# Altium schematic sheet Power Sources and Supply.SchDoc
size Tabloid; DrawnBy: Krutav Shah; SheetNumber: 4; SheetTotal: 6
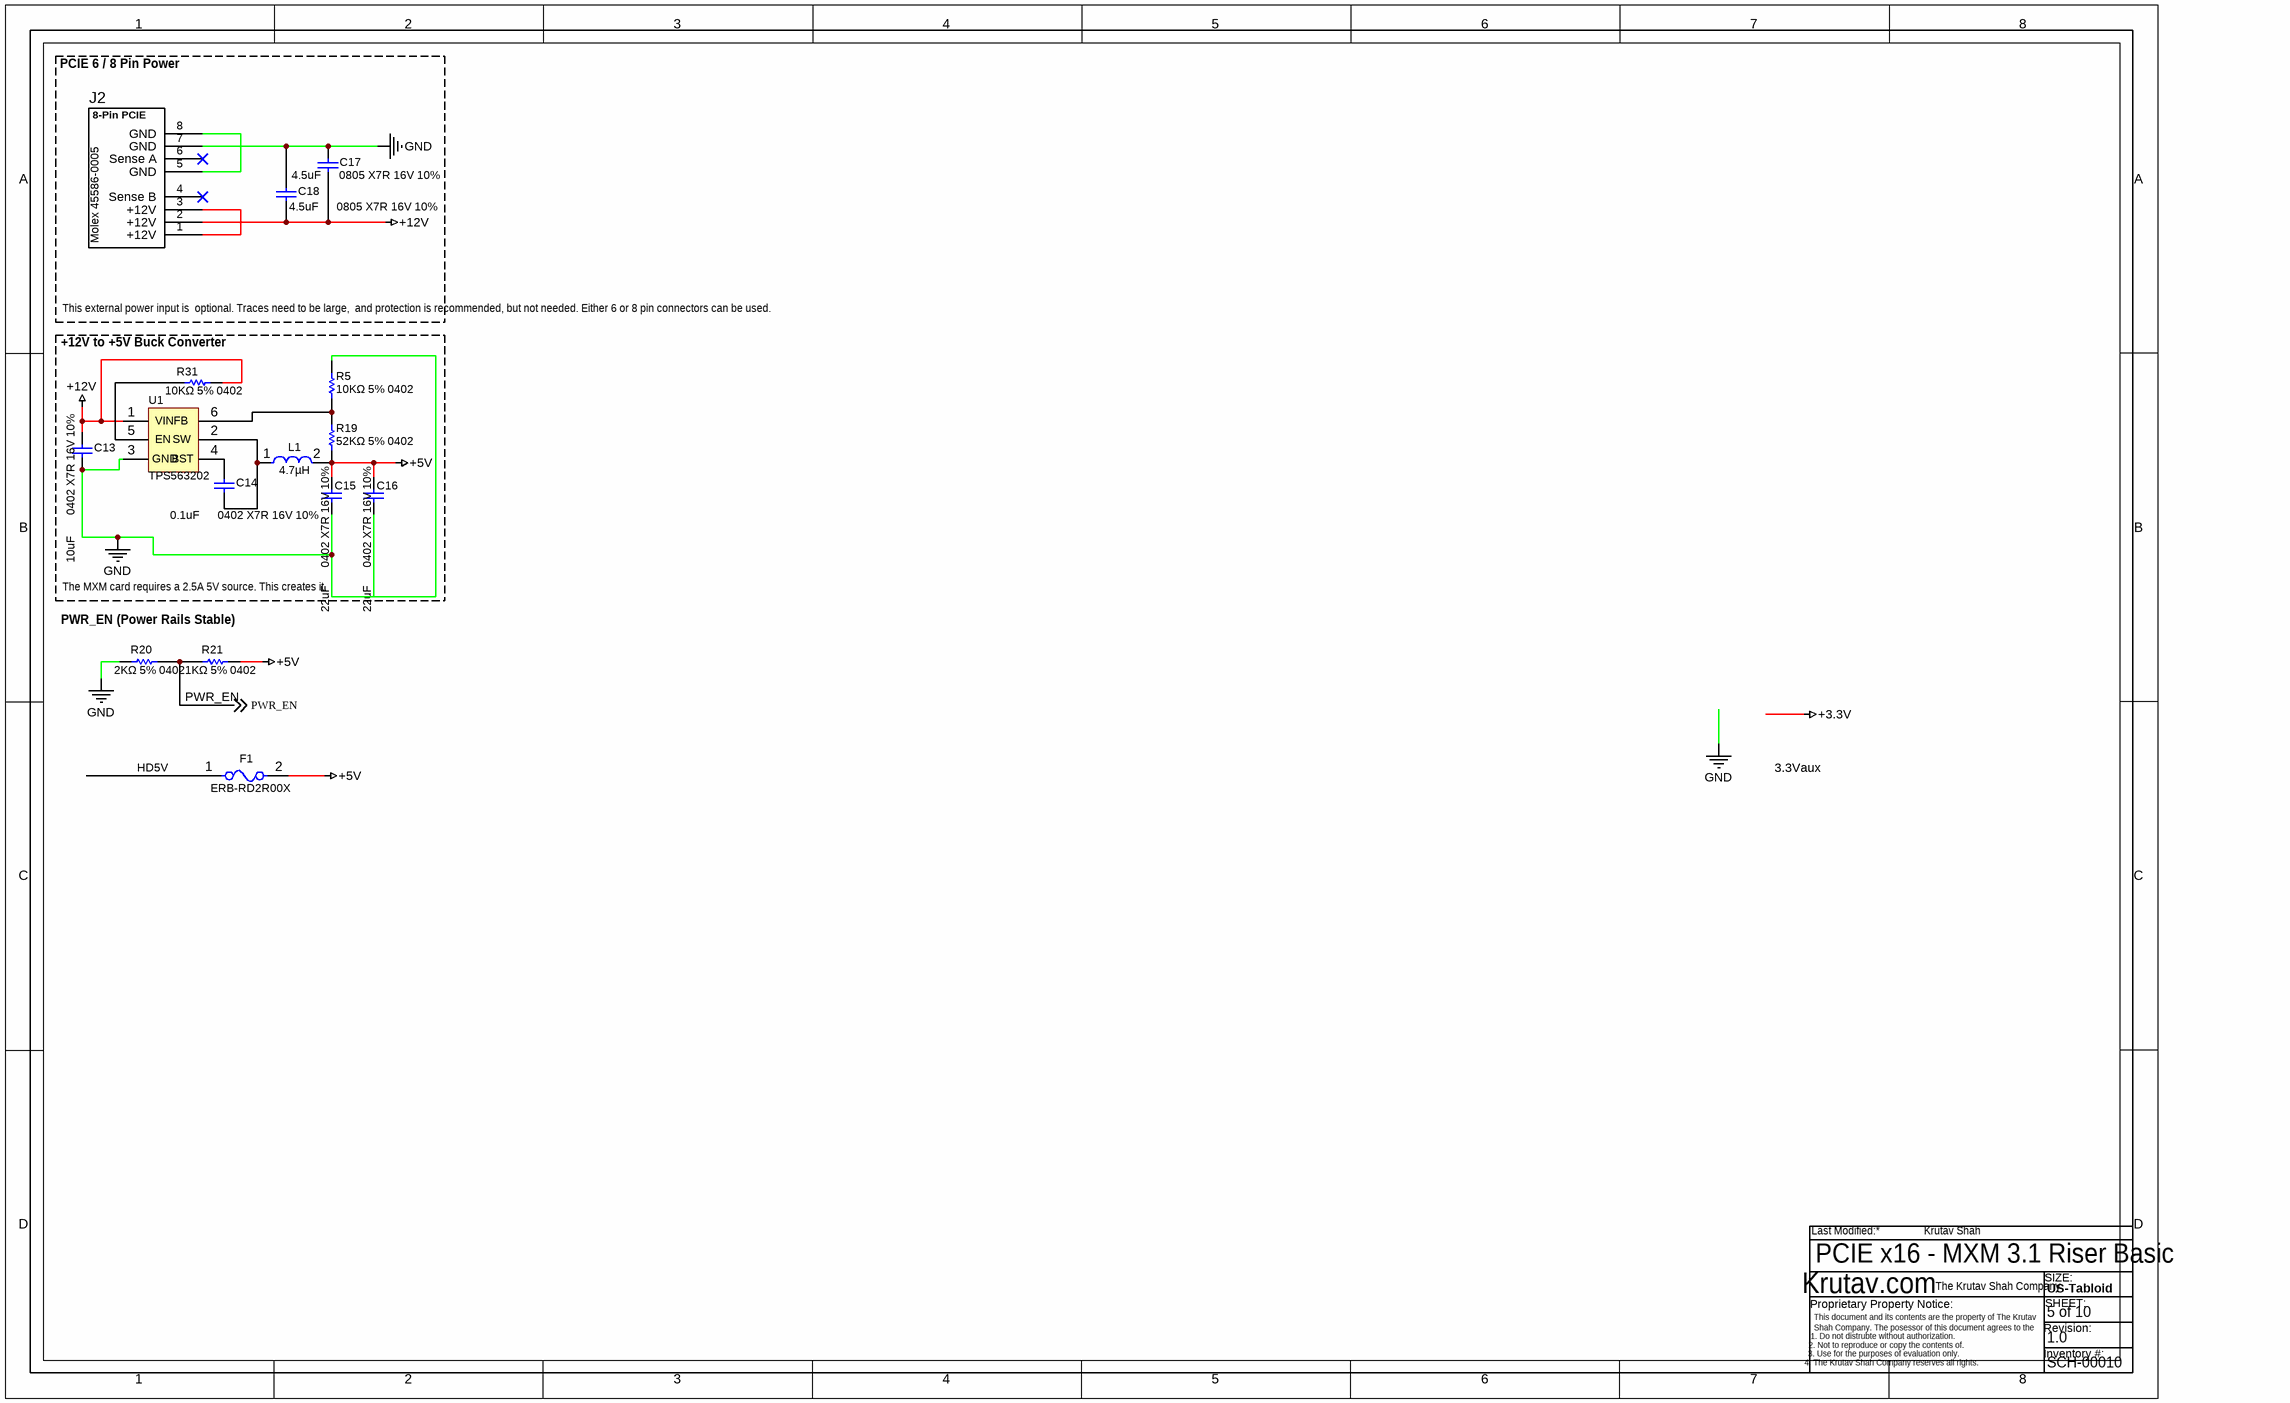
[diagram p0: Power Sources and Supply.SchDoc]

## Parts
C13  10uF       0402 X7R 16V 10%  [CAPC0603X33X15NL03T05]
C14  0.1uF      0402 X7R 16V 10%  [CAPC0603X33X15NL03T05]
C15  22uF      0402 X7R 16V 10%  [CAPC0603X33X15NL03T05]
C16  22uF      0402 X7R 16V 10%  [CAPC0603X33X15NL03T05]
C17  4.5uF      0805 X7R 16V 10%  [CAPC0603X33X15NL03T05]
C18  4.5uF      0805 X7R 16V 10%  [CAPC0603X33X15NL03T05]
F1  ERB-RD2R00X  [FP-ERBRD-MFG]
J2  MOLEX 45586-0005  [Molex_45586-8-Pin-PWR]  (value not drawn)
L1  4.7µH  [FP-IHLP-4040DZ-FP_3_124x3-MFG]
R5  10KΩ 5% 0402  [RESC0201(0603)_L]
R19  52KΩ 5% 0402  [RESC0201(0603)_L]
R20  2KΩ 5% 0402  [RESC0201(0603)_L]
R21  1KΩ 5% 0402  [RESC0201(0603)_L]
R31  10KΩ 5% 0402  [RESC0201(0603)_L]
U1  TPS563202  [ONSC-SOT-563-6-463A-01_V]

## Blocks framed on the sheet
PCIE 6 / 8 Pin Power: C17 C18 J2
+12V to +5V Buck Converter: C13-C16 L1 R5 R19 R31 U1

## Nets
+5V: C15.1 C16.1 F1.2 L1.2 R19.1 R21.2
+12V: C13.2 C17.1 C18.1 J2.2(+12V) R31.1 U1.1(VIN)
GND: C13.1 C15.2 C17.2 C18.2 J2.7(GND) R5.1 R20.1 U1.3(GND)
PWR_EN: R20.2 R21.1 ; off-sheet PWR_EN
NetC14_1: C14.1 L1.1 U1.2(SW)
NetC14_2: C14.2 U1.4(BST)
NetJ2_1: J2.1(+12V) J2.3(+12V)
NetJ2_5: J2.5(GND) J2.8(GND)
NetR5_2: R5.2 R19.2 U1.6(FB)
NetR31_2: R31.2 U1.5(EN)

Not connected (* = marked no-connect by the designer): C16 2; F1 1; J2 4(Sense_B)* 6(Sense_A)*

## Notes on the sheet
- This external power input is
  optional. Traces need to be large,
  and protection is recommended,
  but not needed. Either 6 or 8 pin connectors can be used.
- The MXM card requires a 2.5A 5V source. This creates it.
- PWR_EN (Power Rails Stable)
- HD5V
- PCIE x16 - MXM 3.1 Riser Basic
- 5 of 10
- 1.0
- SCH-00010
- Labels drawn without touching a wire or pin: 3.3Vaux
- Last Modified:
- Krutav.com
- The Krutav Shah Company
- US-Tabloid
- SIZE:
- SHEET:
- This document and its contents are the property of The Krutav Shah Company. The posessor of this document agrees to the following:
- Proprietary Property Notice:
- 1. Do not distrubte without authorization.
- 3. Use for the purposes of evaluation only.
- 2. Not to reproduce or copy the contents of.
- 4. The Krutav Shah Company reserves all rights.
- Revision:
- Inventory #:
- (in symbol Component_1) 8-Pin PCIE; Molex 45586-0005

## Library data of the parts
C13-C18 = CMP-2010-00679-1: Manufacturer: Samsung; Part Number: CL03A224MQ3NNNC
F1 = CMP-05590-000001-1: FUSE BOARD MOUNT 2A 32VDC 0402; Manufacturer: Panasonic Electronic Components; Resistance: 53mΩ; Value: 53mΩ; Voltage Rating: 32V; Fuse Interrupt Dc Current: 35A; Fuse Blow Speed: Fast; Digikey Description: FUSE BOARD MOUNT 2A 32VDC 0402; ComponentLink2Description: Datasheet; Fuse Current: 2A; Device Class L2: Fuses; Category: Fuse; Octopart: https://octopart.com/erb-rd2r00x-panasonic-21220532; RoHS: TRUE; Device Class L1: Circuit Protection; Temperature Range High: +125°C; Height: 0.49mm; Device Class L3: unset; Max Fuse Dc Voltage: 32V; Automotive: No; Manufacturer Part Number: ERB-RD2R00X; Lead Free: Yes; Temperature Range Low: -40°C; Mouser Description: Surface Mount Fuses 2A 0402 micro chip; ComponentLink2URL: https://industrial.panasonic.com/cdbs/www-data/pdf/AFA0000/AFA0000C7.pdf; Temperature: -40°C to +125°C; Package: ERBRD
J2 = Component_1
L1 = CMP-02424-000263-1: Commercial Inductors, High Saturation Series 3.3uH 10A 14.4mΩ 20%; Test Frequency: 100kHz; DC Resistance (DCR): 14.4mR; Shielding: Shielded; Max DC Current: 18.6A; Core Material: Metal; Self Resonant Frequency: 5MHz; Width: 0.405inch; RMS Current (Irms): 10A; Weight: 0.070548oz; Number of Pins: 4040; Height: 4mm; Tolerance: 20%; Contact Plating: Tin; Termination: SMD/SMT; Case Code (Imperial): 4040; Length: 0.43inch; Lead Free: Lead Free; Military Standard: Not; Depth: 10.3mm; Mount: Surface Mount; Radiation Hardening: No; Current Rating: 10A; Min Operating Temperature: -55°C; Height - Seated (Max): 0.157inch; Max Operating Temperature: 125°C; Inductance Tolerance: 20%; Packaging: Tape and Reel; Case/Package: 4040; Package Quantity: 500; Inductance: 3.3uH; Saturation Current: 18.6A
R5 R19-R21 R31 = CMP-1010-00755-1: 1M 0.05W 1% 0201 (0603 Metric)  SMD; Case-Metric: 0603; Value: 1000000.00 Ohm; Case-EIA: 0201; Technology: SMT; Tolerance: 1 %; Power: 0.05 W
U1 = CMP-1063-00200-1: Transient Voltage Suppressor, ESD Protection Diodes with Low Clamping Voltage, 6-Pin SOT-563, Pb-Free, Tape and Reel; PartNumber: NUP4114UPXV6T1G; Manufacturer: On Semiconductor; V(BR) Min (V): 5.5; Direction: Unidirectional; Number of Lines: 4; IR Max (uA): 1; PackageVersion: Rev. F, 04/2005; VRWM Max (V): 5.5; PackageReference: SOT-563-6-463A-01; ComponentLink3URL: http://www.onsemi.cn/pub_link/Collateral/463A-01.PDF; ComponentLink2URL: http://www.onsemi.com/pub_link/Collateral/NUP4114-D.PDF; PackageDescription: 6-Pin Small Outline Transistor, Body 1.6 x 1.2 mm, Pitch 0.5 mm; Packing: Tape and Reel; ComponentLink1Description: Manufacturer URL; ComponentLink3Description: Package Specification; RoHS: Pb-Free; Mounting Technology: Surface Mount; DatasheetVersion: Rev. 2; ComponentLink2Description: Datasheet; ComponentLink1URL: http://www.onsemi.com/